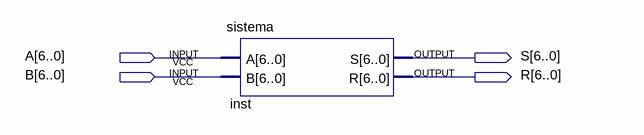
[diagram p0: schematic sheet]
// Quartus schematic testSistema.bdf as structural Verilog: 1 symbols, 4 pins
module testSistema (
  input  [6:0] A,
  input  [6:0] B,
  output [6:0] S,
  output [6:0] R
);

  sistema inst (.A(A), .B(B), .S(S), .R(R));
endmodule
